# Altium schematic sheet Dash.SchDoc: DASH BREAKAWAY
size A4; CheckedBy: TIMOTHY WARNOCK; Author: TIMOTHY WARNOCK; CompanyName: CURTIN MOTORSPORT TEAM; DrawnBy: TIMOTHY WARNOCK; Engineer: TIMOTHY WARNOCK; Revision: 2; SheetNumber: 4; SheetTotal: 5; ProjectName: 2017 PERMANENT LOOM
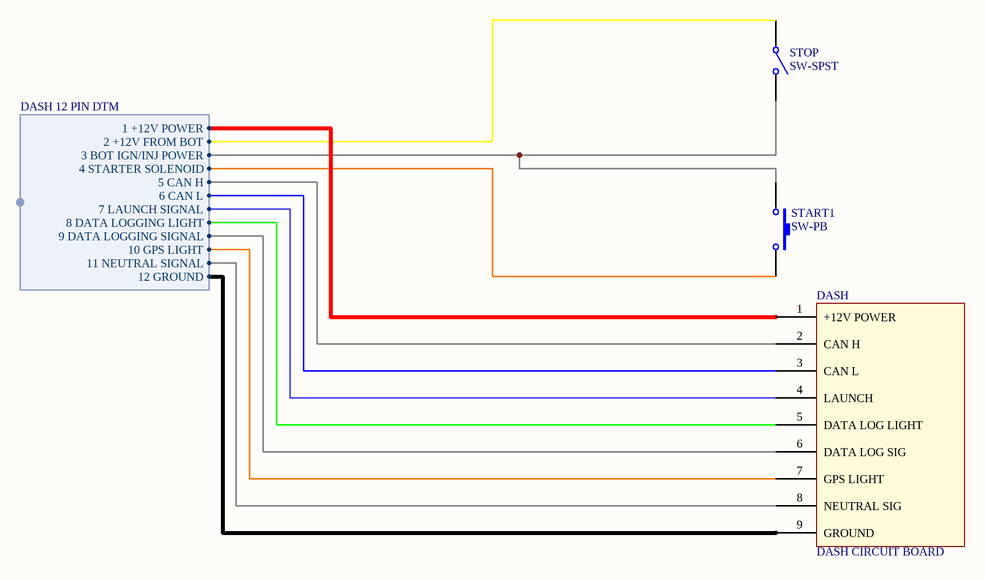
[diagram p0: Dash.SchDoc]

## Parts
DASH  DASH CIRCUIT BOARD
START1  SW-PB  [SPST-2]
STOP  SW-SPST  [SPST-2]

## Harnesses
DASH 12 PIN DTM: 1 +12V POWER, 2 +12V FROM BOT, 3 BOT IGN/INJ POWER, 4 STARTER SOLENOID, 5 CAN H, 6 CAN L, 7 LAUNCH SIGNAL, 8 DATA LOGGING LIGHT, 9 DATA LOGGING SIGNAL, 10 GPS LIGHT, 11 NEUTRAL SIGNAL, 12 GROUND

## Nets
NetDASH_1: DASH.1(+12V_POWER) ; harness DASH 12 PIN DTM.1 +12V POWER
NetDASH_2: DASH.2(CAN_H) ; harness DASH 12 PIN DTM.5 CAN H
NetDASH_3: DASH.3(CAN_L) ; harness DASH 12 PIN DTM.6 CAN L
NetDASH_4: DASH.4(LAUNCH) ; harness DASH 12 PIN DTM.7 LAUNCH SIGNAL
NetDASH_5: DASH.5(DATA_LOG_LIGHT) ; harness DASH 12 PIN DTM.8 DATA LOGGING LIGHT
NetDASH_6: DASH.6(DATA_LOG_SIG) ; harness DASH 12 PIN DTM.9 DATA LOGGING SIGNAL
NetDASH_7: DASH.7(GPS_LIGHT) ; harness DASH 12 PIN DTM.10 GPS LIGHT
NetDASH_8: DASH.8(NEUTRAL_SIG) ; harness DASH 12 PIN DTM.11 NEUTRAL SIGNAL
NetDASH_9: DASH.9(GROUND) ; harness DASH 12 PIN DTM.12 GROUND
NetSTART1_1: START1.1 STOP.2(NO) ; harness DASH 12 PIN DTM.3 BOT IGN/INJ POWER
NetSTART1_2: START1.2 ; harness DASH 12 PIN DTM.4 STARTER SOLENOID
NetSTOP_1: STOP.1(COMMON) ; harness DASH 12 PIN DTM.2 +12V FROM BOT

## Notes on the sheet
- Title
- Size:
- Date:
- A4
- Number:
- Time:
- Revision:
- Sheet
- of
- File:

## Library data of the parts
START1 = SW-PB: Switch; Published: 24-Mar-1999; LatestRevisionDate: 17-Jul-2002; LatestRevisionNote: Re-released for DXP Platform.; PackageReference: SPST-2; Publisher: Altium Limited; PackageDescription: Switch; 2 Leads
STOP = SW-SPST: Single-Pole, Single-Throw Switch; Published: 24-Mar-1999; LatestRevisionDate: 17-Jul-2002; LatestRevisionNote: Re-released for DXP Platform.; PackageReference: SPST-2; Publisher: Altium Limited; PackageDescription: Switch; 2 Leads